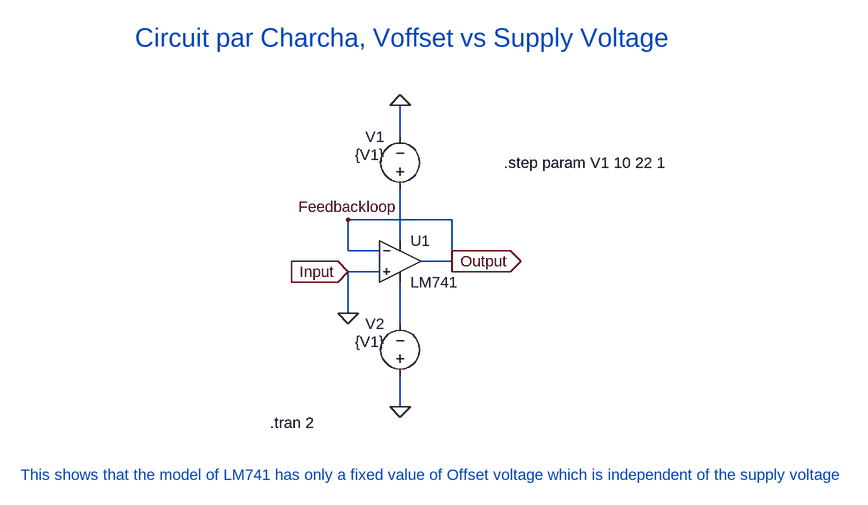
[diagram p0: schematic OpAmpDCOffsetDemo2.asc]
OpAmpDCOffsetDemo2.asc, the LTspice schematic file:
Version 4
SHEET 1 1012 680
WIRE 208 -48 208 -96
WIRE 288 80 128 80
WIRE 208 112 208 32
WIRE 128 128 128 80
WIRE 176 128 128 128
WIRE 288 144 288 80
WIRE 288 144 240 144
WIRE 176 160 128 160
WIRE 128 224 128 160
WIRE 208 240 208 176
WIRE 208 368 208 320
FLAG 128 224 0
FLAG 208 -96 0
FLAG 208 368 0
FLAG 288 144 Output
IOPIN 288 144 Out
FLAG 128 160 Input
IOPIN 128 160 In
FLAG 128 80 Feedbackloop
SYMBOL OpAmps\\LM741 208 80 R0
SYMATTR InstName U1
SYMBOL voltage 208 48 R180
WINDOW 0 24 96 Left 2
WINDOW 3 24 68 Left 2
WINDOW 123 0 0 Left 0
WINDOW 39 0 0 Left 0
SYMATTR InstName V1
SYMATTR Value {V1}
SYMBOL voltage 208 336 R180
WINDOW 0 24 96 Left 2
WINDOW 3 24 68 Left 2
WINDOW 123 0 0 Left 0
WINDOW 39 0 0 Left 0
SYMATTR InstName V2
SYMATTR Value {V1}
TEXT 8 392 Left 2 !.tran 2
TEXT 368 -8 Left 2 !.step param V1 10 22 1
TEXT -376 472 Left 2 ;This shows that the model of LM741 has only a fixed value of Offset voltage which is independent of the supply voltage
TEXT -200 -200 Left 4 ;Circuit par Charcha, Voffset vs Supply Voltage

The netlist it stands for:
* OpAmpDCOffsetDemo2.asc
XU1 0 Feedbackloop N001 N002 Feedbackloop LM741  ; pins In+ In- V+ V- OUT
V1 N001 0 {V1}
V2 0 N002 {V1}
.tran 2
.step param V1 10 22 1
* This shows that the model of LM741 has only a fixed value of Offset voltage which is independent of the supply voltage
* Circuit par Charcha, Voffset vs Supply Voltage
.lib LM741.lib
.backanno
.end